# Altium schematic sheet ALL_channels.SchDoc
size A2; DocumentNumber: 4; SheetNumber: 2; SheetTotal: 5
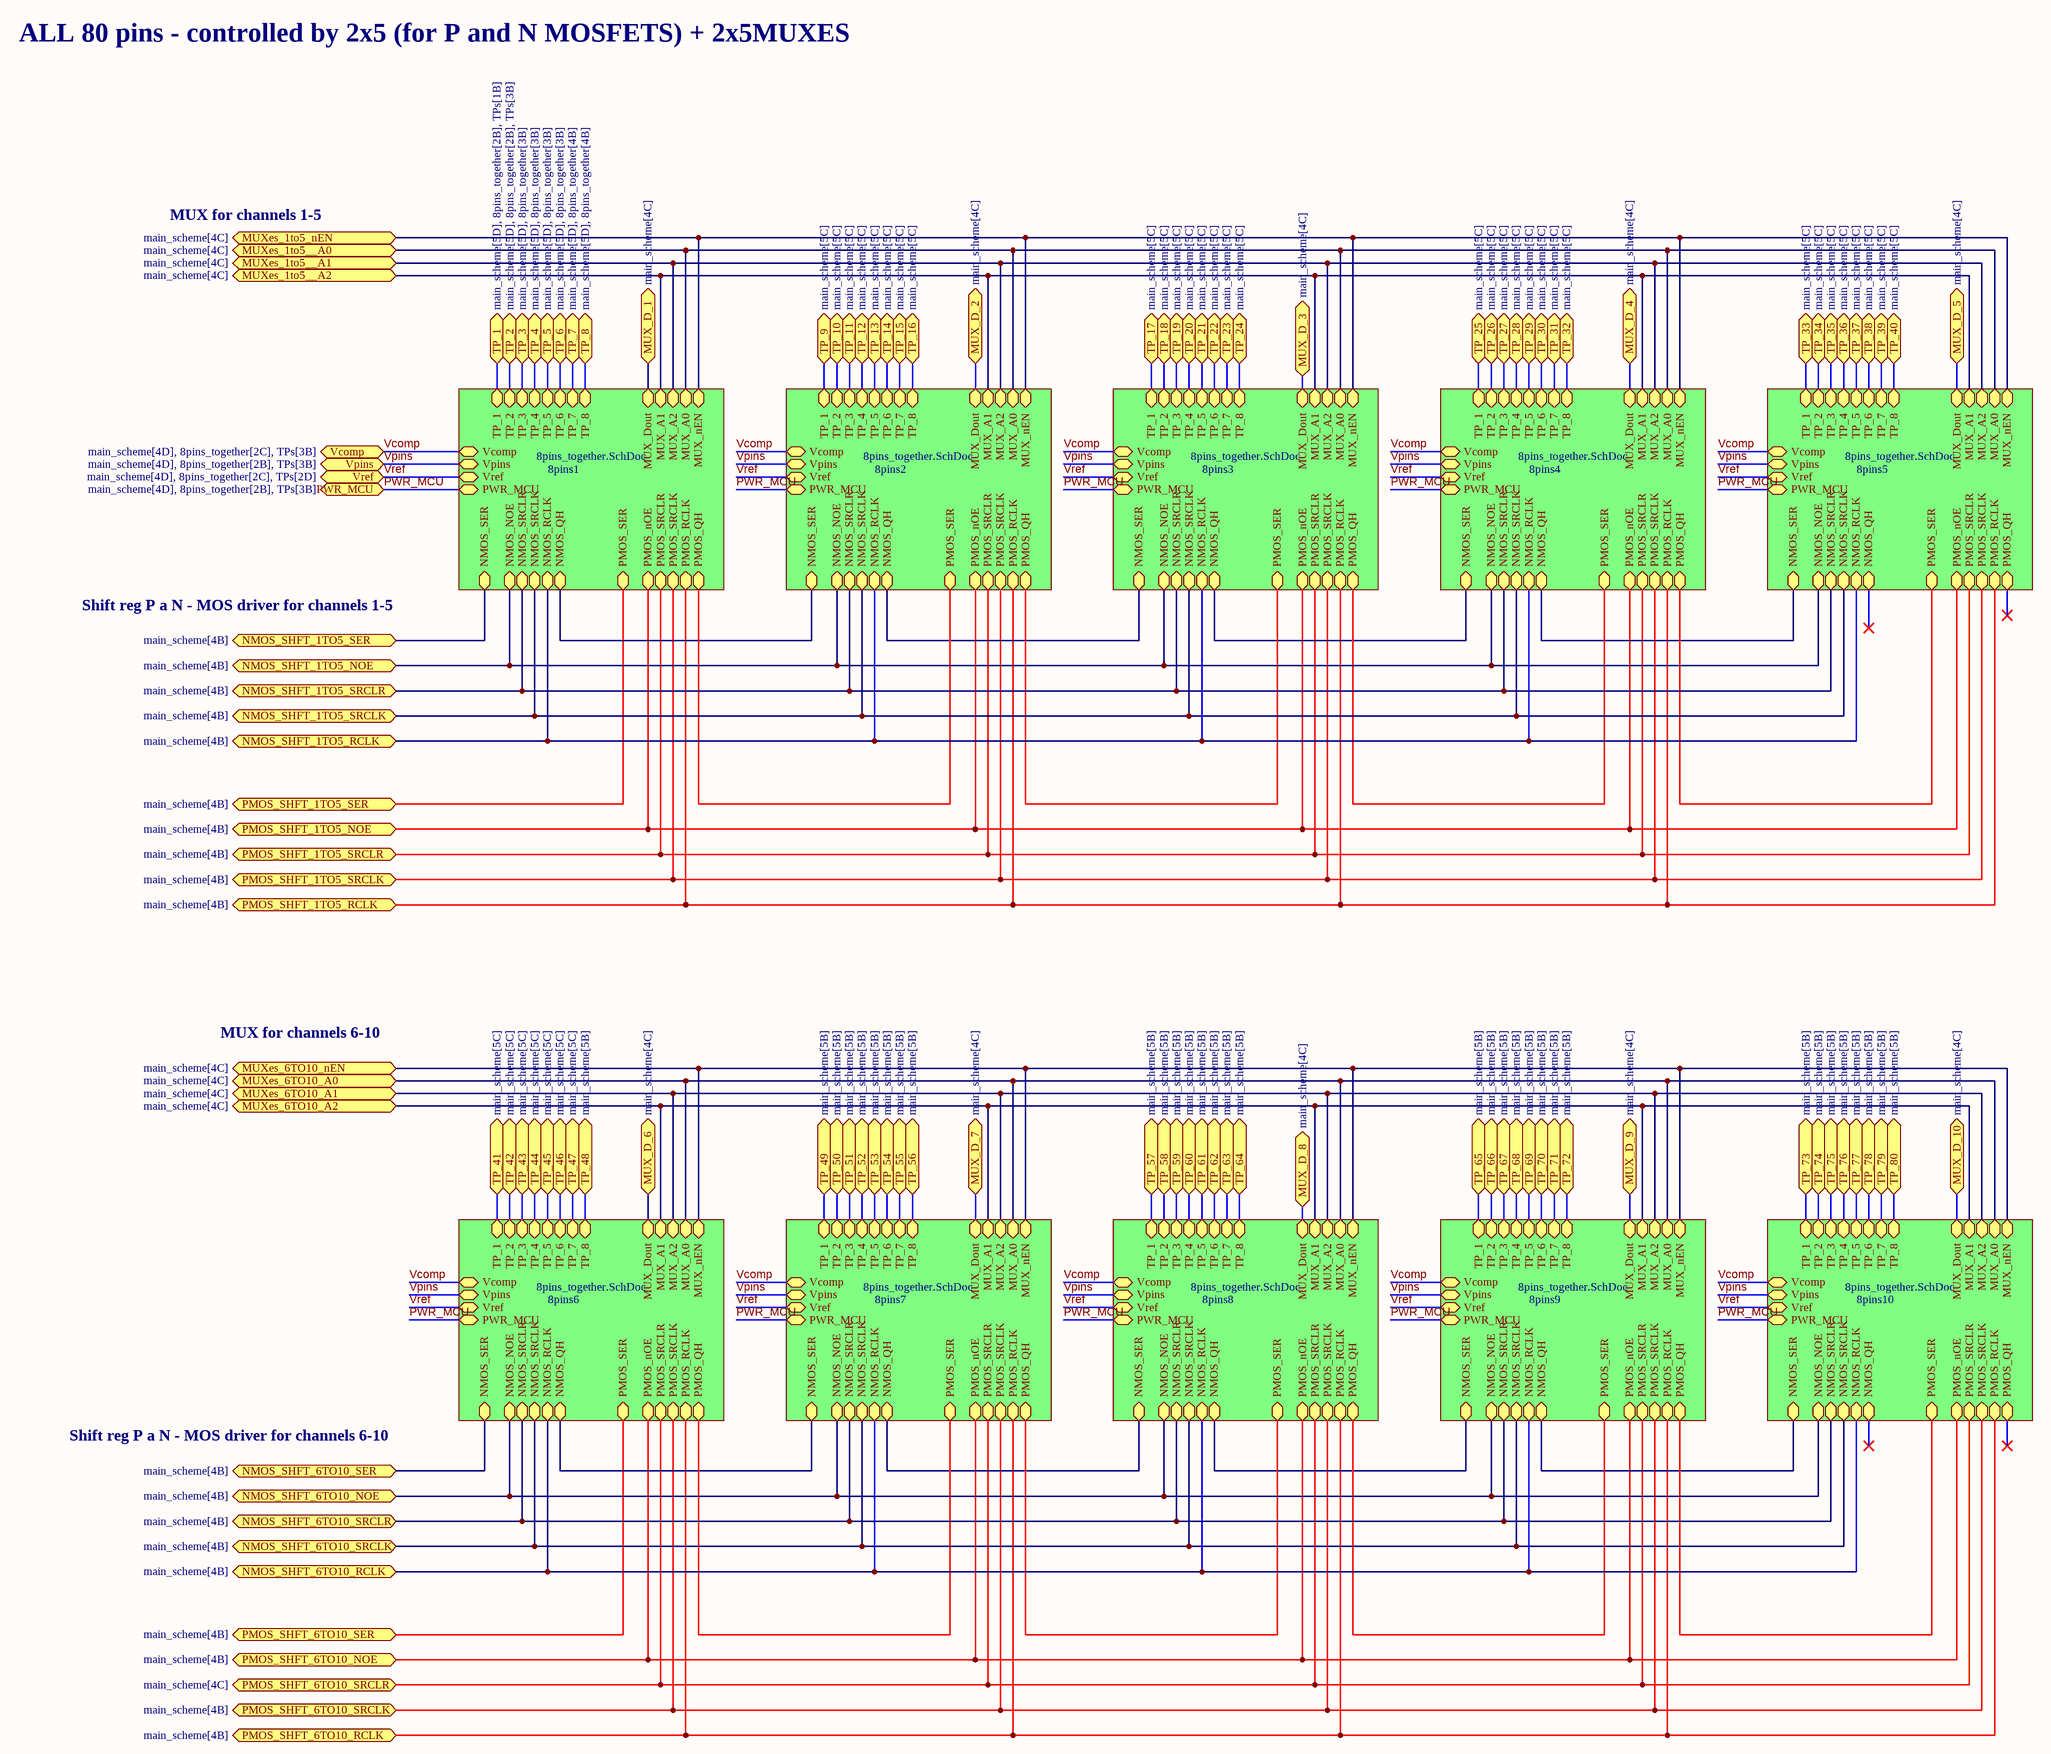
[diagram p0: ALL_channels.SchDoc]

## Sub-sheets
8pins1 = 8pins_together.SchDoc: TP_1 (bidir), TP_2 (bidir), TP_3 (bidir), TP_4 (bidir), TP_5 (bidir), TP_6 (bidir), TP_7 (bidir), TP_8 (bidir), MUX_nEN (bidir), MUX_Dout (bidir), MUX_A0 (bidir), MUX_A1 (bidir), MUX_A2 (bidir), Vcomp (bidir), Vref (bidir), PWR_MCU (bidir), Vpins (bidir), NMOS_QH (bidir), PMOS_QH (bidir), NMOS_RCLK (bidir), NMOS_NOE (bidir), NMOS_SRCLK (bidir), NMOS_SRCLR (bidir), NMOS_SER (bidir), PMOS_RCLK (bidir), PMOS_nOE (bidir), PMOS_SRCLK (bidir), PMOS_SRCLR (bidir), PMOS_SER (bidir)
8pins2 = 8pins_together.SchDoc: TP_1 (bidir), TP_2 (bidir), TP_3 (bidir), TP_4 (bidir), TP_5 (bidir), TP_6 (bidir), TP_7 (bidir), TP_8 (bidir), MUX_nEN (bidir), MUX_Dout (bidir), MUX_A0 (bidir), MUX_A1 (bidir), MUX_A2 (bidir), Vcomp (bidir), Vref (bidir), PWR_MCU (bidir), Vpins (bidir), NMOS_QH (bidir), PMOS_QH (bidir), NMOS_RCLK (bidir), NMOS_NOE (bidir), NMOS_SRCLK (bidir), NMOS_SRCLR (bidir), NMOS_SER (bidir), PMOS_RCLK (bidir), PMOS_nOE (bidir), PMOS_SRCLK (bidir), PMOS_SRCLR (bidir), PMOS_SER (bidir)
8pins3 = 8pins_together.SchDoc: TP_1 (bidir), TP_2 (bidir), TP_3 (bidir), TP_4 (bidir), TP_5 (bidir), TP_6 (bidir), TP_7 (bidir), TP_8 (bidir), MUX_nEN (bidir), MUX_Dout (bidir), MUX_A0 (bidir), MUX_A1 (bidir), MUX_A2 (bidir), Vcomp (bidir), Vref (bidir), PWR_MCU (bidir), Vpins (bidir), NMOS_QH (bidir), PMOS_QH (bidir), NMOS_RCLK (bidir), NMOS_NOE (bidir), NMOS_SRCLK (bidir), NMOS_SRCLR (bidir), NMOS_SER (bidir), PMOS_RCLK (bidir), PMOS_nOE (bidir), PMOS_SRCLK (bidir), PMOS_SRCLR (bidir), PMOS_SER (bidir)
8pins4 = 8pins_together.SchDoc: TP_1 (bidir), TP_2 (bidir), TP_3 (bidir), TP_4 (bidir), TP_5 (bidir), TP_6 (bidir), TP_7 (bidir), TP_8 (bidir), MUX_nEN (bidir), MUX_Dout (bidir), MUX_A0 (bidir), MUX_A1 (bidir), MUX_A2 (bidir), Vcomp (bidir), Vref (bidir), PWR_MCU (bidir), Vpins (bidir), NMOS_QH (bidir), PMOS_QH (bidir), NMOS_RCLK (bidir), NMOS_NOE (bidir), NMOS_SRCLK (bidir), NMOS_SRCLR (bidir), NMOS_SER (bidir), PMOS_RCLK (bidir), PMOS_nOE (bidir), PMOS_SRCLK (bidir), PMOS_SRCLR (bidir), PMOS_SER (bidir)
8pins5 = 8pins_together.SchDoc: TP_1 (bidir), TP_2 (bidir), TP_3 (bidir), TP_4 (bidir), TP_5 (bidir), TP_6 (bidir), TP_7 (bidir), TP_8 (bidir), MUX_nEN (bidir), MUX_Dout (bidir), MUX_A0 (bidir), MUX_A1 (bidir), MUX_A2 (bidir), Vcomp (bidir), Vref (bidir), PWR_MCU (bidir), Vpins (bidir), NMOS_QH (bidir), PMOS_QH (bidir), NMOS_RCLK (bidir), NMOS_NOE (bidir), NMOS_SRCLK (bidir), NMOS_SRCLR (bidir), NMOS_SER (bidir), PMOS_RCLK (bidir), PMOS_nOE (bidir), PMOS_SRCLK (bidir), PMOS_SRCLR (bidir), PMOS_SER (bidir)
8pins6 = 8pins_together.SchDoc: TP_1 (bidir), TP_2 (bidir), TP_3 (bidir), TP_4 (bidir), TP_5 (bidir), TP_6 (bidir), TP_7 (bidir), TP_8 (bidir), MUX_nEN (bidir), MUX_Dout (bidir), MUX_A0 (bidir), MUX_A1 (bidir), MUX_A2 (bidir), Vcomp (bidir), Vref (bidir), PWR_MCU (bidir), Vpins (bidir), NMOS_QH (bidir), PMOS_QH (bidir), NMOS_RCLK (bidir), NMOS_NOE (bidir), NMOS_SRCLK (bidir), NMOS_SRCLR (bidir), NMOS_SER (bidir), PMOS_RCLK (bidir), PMOS_nOE (bidir), PMOS_SRCLK (bidir), PMOS_SRCLR (bidir), PMOS_SER (bidir)
8pins7 = 8pins_together.SchDoc: TP_1 (bidir), TP_2 (bidir), TP_3 (bidir), TP_4 (bidir), TP_5 (bidir), TP_6 (bidir), TP_7 (bidir), TP_8 (bidir), MUX_nEN (bidir), MUX_Dout (bidir), MUX_A0 (bidir), MUX_A1 (bidir), MUX_A2 (bidir), Vcomp (bidir), Vref (bidir), PWR_MCU (bidir), Vpins (bidir), NMOS_QH (bidir), PMOS_QH (bidir), NMOS_RCLK (bidir), NMOS_NOE (bidir), NMOS_SRCLK (bidir), NMOS_SRCLR (bidir), NMOS_SER (bidir), PMOS_RCLK (bidir), PMOS_nOE (bidir), PMOS_SRCLK (bidir), PMOS_SRCLR (bidir), PMOS_SER (bidir)
8pins8 = 8pins_together.SchDoc: TP_1 (bidir), TP_2 (bidir), TP_3 (bidir), TP_4 (bidir), TP_5 (bidir), TP_6 (bidir), TP_7 (bidir), TP_8 (bidir), MUX_nEN (bidir), MUX_Dout (bidir), MUX_A0 (bidir), MUX_A1 (bidir), MUX_A2 (bidir), Vcomp (bidir), Vref (bidir), PWR_MCU (bidir), Vpins (bidir), NMOS_QH (bidir), PMOS_QH (bidir), NMOS_RCLK (bidir), NMOS_NOE (bidir), NMOS_SRCLK (bidir), NMOS_SRCLR (bidir), NMOS_SER (bidir), PMOS_RCLK (bidir), PMOS_nOE (bidir), PMOS_SRCLK (bidir), PMOS_SRCLR (bidir), PMOS_SER (bidir)
8pins9 = 8pins_together.SchDoc: TP_1 (bidir), TP_2 (bidir), TP_3 (bidir), TP_4 (bidir), TP_5 (bidir), TP_6 (bidir), TP_7 (bidir), TP_8 (bidir), MUX_nEN (bidir), MUX_Dout (bidir), MUX_A0 (bidir), MUX_A1 (bidir), MUX_A2 (bidir), Vcomp (bidir), Vref (bidir), PWR_MCU (bidir), Vpins (bidir), NMOS_QH (bidir), PMOS_QH (bidir), NMOS_RCLK (bidir), NMOS_NOE (bidir), NMOS_SRCLK (bidir), NMOS_SRCLR (bidir), NMOS_SER (bidir), PMOS_RCLK (bidir), PMOS_nOE (bidir), PMOS_SRCLK (bidir), PMOS_SRCLR (bidir), PMOS_SER (bidir)
8pins10 = 8pins_together.SchDoc: TP_1 (bidir), TP_2 (bidir), TP_3 (bidir), TP_4 (bidir), TP_5 (bidir), TP_6 (bidir), TP_7 (bidir), TP_8 (bidir), MUX_nEN (bidir), MUX_Dout (bidir), MUX_A0 (bidir), MUX_A1 (bidir), MUX_A2 (bidir), Vcomp (bidir), Vref (bidir), PWR_MCU (bidir), Vpins (bidir), NMOS_QH (bidir), PMOS_QH (bidir), NMOS_RCLK (bidir), NMOS_NOE (bidir), NMOS_SRCLK (bidir), NMOS_SRCLR (bidir), NMOS_SER (bidir), PMOS_RCLK (bidir), PMOS_nOE (bidir), PMOS_SRCLK (bidir), PMOS_SRCLR (bidir), PMOS_SER (bidir)

## Ports
MUX_D_1 (bidir, see main_scheme[4C]), MUX_D_2 (bidir, see main_scheme[4C]), MUX_D_3 (bidir, see main_scheme[4C]), MUX_D_4 (bidir, see main_scheme[4C]), MUX_D_5 (bidir, see main_scheme[4C]), MUX_D_6 (bidir, see main_scheme[4C]), MUX_D_7 (bidir, see main_scheme[4C]), MUX_D_8 (bidir, see main_scheme[4C]), MUX_D_9 (bidir, see main_scheme[4C]), MUX_D_10 (bidir, see main_scheme[4C]), MUXes_1to5__A0 (bidir, see main_scheme[4C]), MUXes_1to5__A1 (bidir, see main_scheme[4C]), MUXes_1to5__A2 (bidir, see main_scheme[4C]), MUXes_1to5_nEN (bidir, see main_scheme[4C]), MUXes_6TO10_A0 (bidir, see main_scheme[4C]), MUXes_6TO10_A1 (bidir, see main_scheme[4C]), MUXes_6TO10_A2 (bidir, see main_scheme[4C]), MUXes_6TO10_nEN (bidir, see main_scheme[4C]), NMOS_SHFT_1TO5_NOE (bidir, see main_scheme[4B]), NMOS_SHFT_1TO5_RCLK (bidir, see main_scheme[4B]), NMOS_SHFT_1TO5_SER (bidir, see main_scheme[4B]), NMOS_SHFT_1TO5_SRCLK (bidir, see main_scheme[4B]), NMOS_SHFT_1TO5_SRCLR (bidir, see main_scheme[4B]), NMOS_SHFT_6TO10_NOE (bidir, see main_scheme[4B]), NMOS_SHFT_6TO10_RCLK (bidir, see main_scheme[4B]), NMOS_SHFT_6TO10_SER (bidir, see main_scheme[4B]), NMOS_SHFT_6TO10_SRCLK (bidir, see main_scheme[4B]), NMOS_SHFT_6TO10_SRCLR (bidir, see main_scheme[4B]), PMOS_SHFT_1TO5_NOE (bidir, see main_scheme[4B]), PMOS_SHFT_1TO5_RCLK (bidir, see main_scheme[4B]), PMOS_SHFT_1TO5_SER (bidir, see main_scheme[4B]), PMOS_SHFT_1TO5_SRCLK (bidir, see main_scheme[4B]), PMOS_SHFT_1TO5_SRCLR (bidir, see main_scheme[4B]), PMOS_SHFT_6TO10_NOE (bidir, see main_scheme[4B]), PMOS_SHFT_6TO10_RCLK (bidir, see main_scheme[4B]), PMOS_SHFT_6TO10_SER (bidir, see main_scheme[4B]), PMOS_SHFT_6TO10_SRCLK (bidir, see main_scheme[4B]), PMOS_SHFT_6TO10_SRCLR (bidir, see main_scheme[4C]), PWR_MCU (bidir, see main_scheme[4D], 8pins_together[2B], TPs[3B]), TP_1 (bidir, see main_scheme[5D], 8pins_together[2B], TPs[1B]), TP_2 (bidir, see main_scheme[5D], 8pins_together[2B], TPs[3B]), TP_3 (bidir, see main_scheme[5D], 8pins_together[3B]), TP_4 (bidir, see main_scheme[5D], 8pins_together[3B]), TP_5 (bidir, see main_scheme[5D], 8pins_together[3B]), TP_6 (bidir, see main_scheme[5D], 8pins_together[3B]), TP_7 (bidir, see main_scheme[5D], 8pins_together[4B]), TP_8 (bidir, see main_scheme[5D], 8pins_together[4B]), TP_9 (bidir, see main_scheme[5C]), TP_10 (bidir, see main_scheme[5C]), TP_11 (bidir, see main_scheme[5C]), TP_12 (bidir, see main_scheme[5C]), TP_13 (bidir, see main_scheme[5C]), TP_14 (bidir, see main_scheme[5C]), TP_15 (bidir, see main_scheme[5C]), TP_16 (bidir, see main_scheme[5C]), TP_17 (bidir, see main_scheme[5C]), TP_18 (bidir, see main_scheme[5C]), TP_19 (bidir, see main_scheme[5C]), TP_20 (bidir, see main_scheme[5C]), TP_21 (bidir, see main_scheme[5C]), TP_22 (bidir, see main_scheme[5C]), TP_23 (bidir, see main_scheme[5C]), TP_24 (bidir, see main_scheme[5C]), TP_25 (bidir, see main_scheme[5C]), TP_26 (bidir, see main_scheme[5C]), TP_27 (bidir, see main_scheme[5C]), TP_28 (bidir, see main_scheme[5C]), TP_29 (bidir, see main_scheme[5C]), TP_30 (bidir, see main_scheme[5C]), TP_31 (bidir, see main_scheme[5C]), TP_32 (bidir, see main_scheme[5C]), TP_33 (bidir, see main_scheme[5C]), TP_34 (bidir, see main_scheme[5C]), TP_35 (bidir, see main_scheme[5C]), TP_36 (bidir, see main_scheme[5C]), TP_37 (bidir, see main_scheme[5C]), TP_38 (bidir, see main_scheme[5C]), TP_39 (bidir, see main_scheme[5C]), TP_40 (bidir, see main_scheme[5C]), TP_41 (bidir, see main_scheme[5C]), TP_42 (bidir, see main_scheme[5C]), TP_43 (bidir, see main_scheme[5C]), TP_44 (bidir, see main_scheme[5C]), TP_45 (bidir, see main_scheme[5C]), TP_46 (bidir, see main_scheme[5C]), TP_47 (bidir, see main_scheme[5C]), TP_48 (bidir, see main_scheme[5B]), TP_49 (bidir, see main_scheme[5B]), TP_50 (bidir, see main_scheme[5B]), TP_51 (bidir, see main_scheme[5B]), TP_52 (bidir, see main_scheme[5B]), TP_53 (bidir, see main_scheme[5B]), TP_54 (bidir, see main_scheme[5B]), TP_55 (bidir, see main_scheme[5B]), TP_56 (bidir, see main_scheme[5B]), TP_57 (bidir, see main_scheme[5B]), TP_58 (bidir, see main_scheme[5B]), TP_59 (bidir, see main_scheme[5B]), TP_60 (bidir, see main_scheme[5B]), TP_61 (bidir, see main_scheme[5B]), TP_62 (bidir, see main_scheme[5B]), TP_63 (bidir, see main_scheme[5B]), TP_64 (bidir, see main_scheme[5B]), TP_65 (bidir, see main_scheme[5B]), TP_66 (bidir, see main_scheme[5B]), TP_67 (bidir, see main_scheme[5B]), TP_68 (bidir, see main_scheme[5B]), TP_69 (bidir, see main_scheme[5B]), TP_70 (bidir, see main_scheme[5B]), TP_71 (bidir, see main_scheme[5B]), TP_72 (bidir, see main_scheme[5B]), TP_73 (bidir, see main_scheme[5B]), TP_74 (bidir, see main_scheme[5B]), TP_75 (bidir, see main_scheme[5B]), TP_76 (bidir, see main_scheme[5B]), TP_77 (bidir, see main_scheme[5B]), TP_78 (bidir, see main_scheme[5B]), TP_79 (bidir, see main_scheme[5B]), TP_80 (bidir, see main_scheme[5B]), Vcomp (bidir, see main_scheme[4D], 8pins_together[2C], TPs[3B]), Vpins (bidir, see main_scheme[4D], 8pins_together[2B], TPs[3B]), Vref (bidir, see main_scheme[4D], 8pins_together[2C], TPs[2D])

## Nets
MUX_D_1: port MUX_D_1, sheet 8pins1/MUX_Dout
MUX_D_2: port MUX_D_2, sheet 8pins2/MUX_Dout
MUX_D_3: port MUX_D_3, sheet 8pins3/MUX_Dout
MUX_D_4: port MUX_D_4, sheet 8pins4/MUX_Dout
MUX_D_5: port MUX_D_5, sheet 8pins5/MUX_Dout
MUX_D_6: port MUX_D_6, sheet 8pins6/MUX_Dout
MUX_D_7: port MUX_D_7, sheet 8pins7/MUX_Dout
MUX_D_8: port MUX_D_8, sheet 8pins8/MUX_Dout
MUX_D_9: port MUX_D_9, sheet 8pins9/MUX_Dout
MUX_D_10: port MUX_D_10, sheet 8pins10/MUX_Dout
MUXes_1to5__A0: port MUXes_1to5__A0, sheet 8pins1/MUX_A0, sheet 8pins2/MUX_A0, sheet 8pins3/MUX_A0, sheet 8pins4/MUX_A0, sheet 8pins5/MUX_A0
MUXes_1to5__A1: port MUXes_1to5__A1, sheet 8pins1/MUX_A2, sheet 8pins2/MUX_A2, sheet 8pins3/MUX_A2, sheet 8pins4/MUX_A2, sheet 8pins5/MUX_A2
MUXes_1to5__A2: port MUXes_1to5__A2, sheet 8pins1/MUX_A1, sheet 8pins2/MUX_A1, sheet 8pins3/MUX_A1, sheet 8pins4/MUX_A1, sheet 8pins5/MUX_A1
MUXes_1to5_nEN: port MUXes_1to5_nEN, sheet 8pins1/MUX_nEN, sheet 8pins2/MUX_nEN, sheet 8pins3/MUX_nEN, sheet 8pins4/MUX_nEN, sheet 8pins5/MUX_nEN
MUXes_6TO10_A0: port MUXes_6TO10_A0, sheet 8pins6/MUX_A0, sheet 8pins7/MUX_A0, sheet 8pins8/MUX_A0, sheet 8pins9/MUX_A0, sheet 8pins10/MUX_A0
MUXes_6TO10_A1: port MUXes_6TO10_A1, sheet 8pins6/MUX_A2, sheet 8pins7/MUX_A2, sheet 8pins8/MUX_A2, sheet 8pins9/MUX_A2, sheet 8pins10/MUX_A2
MUXes_6TO10_A2: port MUXes_6TO10_A2, sheet 8pins6/MUX_A1, sheet 8pins7/MUX_A1, sheet 8pins8/MUX_A1, sheet 8pins9/MUX_A1, sheet 8pins10/MUX_A1
MUXes_6TO10_nEN: port MUXes_6TO10_nEN, sheet 8pins6/MUX_nEN, sheet 8pins7/MUX_nEN, sheet 8pins8/MUX_nEN, sheet 8pins9/MUX_nEN, sheet 8pins10/MUX_nEN
NMOS_SHFT_1TO5_NOE: port NMOS_SHFT_1TO5_NOE, sheet 8pins1/NMOS_NOE, sheet 8pins2/NMOS_NOE, sheet 8pins3/NMOS_NOE, sheet 8pins4/NMOS_NOE, sheet 8pins5/NMOS_NOE
NMOS_SHFT_1TO5_RCLK: port NMOS_SHFT_1TO5_RCLK, sheet 8pins1/NMOS_RCLK, sheet 8pins2/NMOS_RCLK, sheet 8pins3/NMOS_RCLK, sheet 8pins4/NMOS_RCLK, sheet 8pins5/NMOS_RCLK
NMOS_SHFT_1TO5_SER: port NMOS_SHFT_1TO5_SER, sheet 8pins1/NMOS_SER
NMOS_SHFT_1TO5_SRCLK: port NMOS_SHFT_1TO5_SRCLK, sheet 8pins1/NMOS_SRCLK, sheet 8pins2/NMOS_SRCLK, sheet 8pins3/NMOS_SRCLK, sheet 8pins4/NMOS_SRCLK, sheet 8pins5/NMOS_SRCLK
NMOS_SHFT_1TO5_SRCLR: port NMOS_SHFT_1TO5_SRCLR, sheet 8pins1/NMOS_SRCLR, sheet 8pins2/NMOS_SRCLR, sheet 8pins3/NMOS_SRCLR, sheet 8pins4/NMOS_SRCLR, sheet 8pins5/NMOS_SRCLR
NMOS_SHFT_6TO10_NOE: port NMOS_SHFT_6TO10_NOE, sheet 8pins6/NMOS_NOE, sheet 8pins7/NMOS_NOE, sheet 8pins8/NMOS_NOE, sheet 8pins9/NMOS_NOE, sheet 8pins10/NMOS_NOE
NMOS_SHFT_6TO10_RCLK: port NMOS_SHFT_6TO10_RCLK, sheet 8pins6/NMOS_RCLK, sheet 8pins7/NMOS_RCLK, sheet 8pins8/NMOS_RCLK, sheet 8pins9/NMOS_RCLK, sheet 8pins10/NMOS_RCLK
NMOS_SHFT_6TO10_SER: port NMOS_SHFT_6TO10_SER, sheet 8pins6/NMOS_SER
NMOS_SHFT_6TO10_SRCLK: port NMOS_SHFT_6TO10_SRCLK, sheet 8pins6/NMOS_SRCLK, sheet 8pins7/NMOS_SRCLK, sheet 8pins8/NMOS_SRCLK, sheet 8pins9/NMOS_SRCLK, sheet 8pins10/NMOS_SRCLK
NMOS_SHFT_6TO10_SRCLR: port NMOS_SHFT_6TO10_SRCLR, sheet 8pins6/NMOS_SRCLR, sheet 8pins7/NMOS_SRCLR, sheet 8pins8/NMOS_SRCLR, sheet 8pins9/NMOS_SRCLR, sheet 8pins10/NMOS_SRCLR
PMOS_SHFT_1TO5_NOE: port PMOS_SHFT_1TO5_NOE, sheet 8pins1/PMOS_nOE, sheet 8pins2/PMOS_nOE, sheet 8pins3/PMOS_nOE, sheet 8pins4/PMOS_nOE, sheet 8pins5/PMOS_nOE
PMOS_SHFT_1TO5_RCLK: port PMOS_SHFT_1TO5_RCLK, sheet 8pins1/PMOS_RCLK, sheet 8pins2/PMOS_RCLK, sheet 8pins3/PMOS_RCLK, sheet 8pins4/PMOS_RCLK, sheet 8pins5/PMOS_RCLK
PMOS_SHFT_1TO5_SER: port PMOS_SHFT_1TO5_SER, sheet 8pins1/PMOS_SER
PMOS_SHFT_1TO5_SRCLK: port PMOS_SHFT_1TO5_SRCLK, sheet 8pins1/PMOS_SRCLK, sheet 8pins2/PMOS_SRCLK, sheet 8pins3/PMOS_SRCLK, sheet 8pins4/PMOS_SRCLK, sheet 8pins5/PMOS_SRCLK
PMOS_SHFT_1TO5_SRCLR: port PMOS_SHFT_1TO5_SRCLR, sheet 8pins1/PMOS_SRCLR, sheet 8pins2/PMOS_SRCLR, sheet 8pins3/PMOS_SRCLR, sheet 8pins4/PMOS_SRCLR, sheet 8pins5/PMOS_SRCLR
PMOS_SHFT_6TO10_NOE: port PMOS_SHFT_6TO10_NOE, sheet 8pins6/PMOS_nOE, sheet 8pins7/PMOS_nOE, sheet 8pins8/PMOS_nOE, sheet 8pins9/PMOS_nOE, sheet 8pins10/PMOS_nOE
PMOS_SHFT_6TO10_RCLK: port PMOS_SHFT_6TO10_RCLK, sheet 8pins6/PMOS_RCLK, sheet 8pins7/PMOS_RCLK, sheet 8pins8/PMOS_RCLK, sheet 8pins9/PMOS_RCLK, sheet 8pins10/PMOS_RCLK
PMOS_SHFT_6TO10_SER: port PMOS_SHFT_6TO10_SER, sheet 8pins6/PMOS_SER
PMOS_SHFT_6TO10_SRCLK: port PMOS_SHFT_6TO10_SRCLK, sheet 8pins6/PMOS_SRCLK, sheet 8pins7/PMOS_SRCLK, sheet 8pins8/PMOS_SRCLK, sheet 8pins9/PMOS_SRCLK, sheet 8pins10/PMOS_SRCLK
PMOS_SHFT_6TO10_SRCLR: port PMOS_SHFT_6TO10_SRCLR, sheet 8pins6/PMOS_SRCLR, sheet 8pins7/PMOS_SRCLR, sheet 8pins8/PMOS_SRCLR, sheet 8pins9/PMOS_SRCLR, sheet 8pins10/PMOS_SRCLR
PWR_MCU: port PWR_MCU, sheet 8pins1/PWR_MCU, sheet 8pins2/PWR_MCU, sheet 8pins3/PWR_MCU, sheet 8pins4/PWR_MCU, sheet 8pins5/PWR_MCU, sheet 8pins6/PWR_MCU, sheet 8pins7/PWR_MCU, sheet 8pins8/PWR_MCU, sheet 8pins9/PWR_MCU, sheet 8pins10/PWR_MCU
TP_1: port TP_1, sheet 8pins1/TP_1
TP_2: port TP_2, sheet 8pins1/TP_2
TP_3: port TP_3, sheet 8pins1/TP_3
TP_4: port TP_4, sheet 8pins1/TP_4
TP_5: port TP_5, sheet 8pins1/TP_5
TP_6: port TP_6, sheet 8pins1/TP_6
TP_7: port TP_7, sheet 8pins1/TP_7
TP_8: port TP_8, sheet 8pins1/TP_8
TP_9: port TP_9, sheet 8pins2/TP_1
TP_10: port TP_10, sheet 8pins2/TP_2
TP_11: port TP_11, sheet 8pins2/TP_3
TP_12: port TP_12, sheet 8pins2/TP_4
TP_13: port TP_13, sheet 8pins2/TP_5
TP_14: port TP_14, sheet 8pins2/TP_6
TP_15: port TP_15, sheet 8pins2/TP_7
TP_16: port TP_16, sheet 8pins2/TP_8
TP_17: port TP_17, sheet 8pins3/TP_1
TP_18: port TP_18, sheet 8pins3/TP_2
TP_19: port TP_19, sheet 8pins3/TP_3
TP_20: port TP_20, sheet 8pins3/TP_4
TP_21: port TP_21, sheet 8pins3/TP_5
TP_22: port TP_22, sheet 8pins3/TP_6
TP_23: port TP_23, sheet 8pins3/TP_7
TP_24: port TP_24, sheet 8pins3/TP_8
TP_25: port TP_25, sheet 8pins4/TP_1
TP_26: port TP_26, sheet 8pins4/TP_2
TP_27: port TP_27, sheet 8pins4/TP_3
TP_28: port TP_28, sheet 8pins4/TP_4
TP_29: port TP_29, sheet 8pins4/TP_5
TP_30: port TP_30, sheet 8pins4/TP_6
TP_31: port TP_31, sheet 8pins4/TP_7
TP_32: port TP_32, sheet 8pins4/TP_8
TP_33: port TP_33, sheet 8pins5/TP_1
TP_34: port TP_34, sheet 8pins5/TP_2
TP_35: port TP_35, sheet 8pins5/TP_3
TP_36: port TP_36, sheet 8pins5/TP_4
TP_37: port TP_37, sheet 8pins5/TP_5
TP_38: port TP_38, sheet 8pins5/TP_6
TP_39: port TP_39, sheet 8pins5/TP_7
TP_40: port TP_40, sheet 8pins5/TP_8
TP_41: port TP_41, sheet 8pins6/TP_1
TP_42: port TP_42, sheet 8pins6/TP_2
TP_43: port TP_43, sheet 8pins6/TP_3
TP_44: port TP_44, sheet 8pins6/TP_4
TP_45: port TP_45, sheet 8pins6/TP_5
TP_46: port TP_46, sheet 8pins6/TP_6
TP_47: port TP_47, sheet 8pins6/TP_7
TP_48: port TP_48, sheet 8pins6/TP_8
TP_49: port TP_49, sheet 8pins7/TP_1
TP_50: port TP_50, sheet 8pins7/TP_2
TP_51: port TP_51, sheet 8pins7/TP_3
TP_52: port TP_52, sheet 8pins7/TP_4
TP_53: port TP_53, sheet 8pins7/TP_5
TP_54: port TP_54, sheet 8pins7/TP_6
TP_55: port TP_55, sheet 8pins7/TP_7
TP_56: port TP_56, sheet 8pins7/TP_8
TP_57: port TP_57, sheet 8pins8/TP_1
TP_58: port TP_58, sheet 8pins8/TP_2
TP_59: port TP_59, sheet 8pins8/TP_3
TP_60: port TP_60, sheet 8pins8/TP_4
TP_61: port TP_61, sheet 8pins8/TP_5
TP_62: port TP_62, sheet 8pins8/TP_6
TP_63: port TP_63, sheet 8pins8/TP_7
TP_64: port TP_64, sheet 8pins8/TP_8
TP_65: port TP_65, sheet 8pins9/TP_1
TP_66: port TP_66, sheet 8pins9/TP_2
TP_67: port TP_67, sheet 8pins9/TP_3
TP_68: port TP_68, sheet 8pins9/TP_4
TP_69: port TP_69, sheet 8pins9/TP_5
TP_70: port TP_70, sheet 8pins9/TP_6
TP_71: port TP_71, sheet 8pins9/TP_7
TP_72: port TP_72, sheet 8pins9/TP_8
TP_73: port TP_73, sheet 8pins10/TP_1
TP_74: port TP_74, sheet 8pins10/TP_2
TP_75: port TP_75, sheet 8pins10/TP_3
TP_76: port TP_76, sheet 8pins10/TP_4
TP_77: port TP_77, sheet 8pins10/TP_5
TP_78: port TP_78, sheet 8pins10/TP_6
TP_79: port TP_79, sheet 8pins10/TP_7
TP_80: port TP_80, sheet 8pins10/TP_8
Vcomp: port Vcomp, sheet 8pins1/Vcomp, sheet 8pins2/Vcomp, sheet 8pins3/Vcomp, sheet 8pins4/Vcomp, sheet 8pins5/Vcomp, sheet 8pins6/Vcomp, sheet 8pins7/Vcomp, sheet 8pins8/Vcomp, sheet 8pins9/Vcomp, sheet 8pins10/Vcomp
Vpins: port Vpins, sheet 8pins1/Vpins, sheet 8pins2/Vpins, sheet 8pins3/Vpins, sheet 8pins4/Vpins, sheet 8pins5/Vpins, sheet 8pins6/Vpins, sheet 8pins7/Vpins, sheet 8pins8/Vpins, sheet 8pins9/Vpins, sheet 8pins10/Vpins
Vref: port Vref, sheet 8pins1/Vref, sheet 8pins2/Vref, sheet 8pins3/Vref, sheet 8pins4/Vref, sheet 8pins5/Vref, sheet 8pins6/Vref, sheet 8pins7/Vref, sheet 8pins8/Vref, sheet 8pins9/Vref, sheet 8pins10/Vref
(unnamed): sheet 8pins1/NMOS_QH, sheet 8pins2/NMOS_SER
(unnamed): sheet 8pins1/PMOS_QH, sheet 8pins2/PMOS_SER
(unnamed): sheet 8pins2/NMOS_QH, sheet 8pins3/NMOS_SER
(unnamed): sheet 8pins2/PMOS_QH, sheet 8pins3/PMOS_SER
(unnamed): sheet 8pins3/NMOS_QH, sheet 8pins4/NMOS_SER
(unnamed): sheet 8pins3/PMOS_QH, sheet 8pins4/PMOS_SER
(unnamed): sheet 8pins4/NMOS_QH, sheet 8pins5/NMOS_SER
(unnamed): sheet 8pins4/PMOS_QH, sheet 8pins5/PMOS_SER
(unnamed): sheet 8pins6/NMOS_QH, sheet 8pins7/NMOS_SER
(unnamed): sheet 8pins6/PMOS_QH, sheet 8pins7/PMOS_SER
(unnamed): sheet 8pins7/NMOS_QH, sheet 8pins8/NMOS_SER
(unnamed): sheet 8pins7/PMOS_QH, sheet 8pins8/PMOS_SER
(unnamed): sheet 8pins8/NMOS_QH, sheet 8pins9/NMOS_SER
(unnamed): sheet 8pins8/PMOS_QH, sheet 8pins9/PMOS_SER
(unnamed): sheet 8pins9/NMOS_QH, sheet 8pins10/NMOS_SER
(unnamed): sheet 8pins9/PMOS_QH, sheet 8pins10/PMOS_SER

## Notes on the sheet
- ALL 80 pins - controlled by 2x5 (for P and N MOSFETS) + 2x5MUXES
- MUX for channels 1-5
- Shift reg P a N - MOS driver for channels 1-5
- MUX for channels 6-10
- Shift reg P a N - MOS driver for channels 6-10